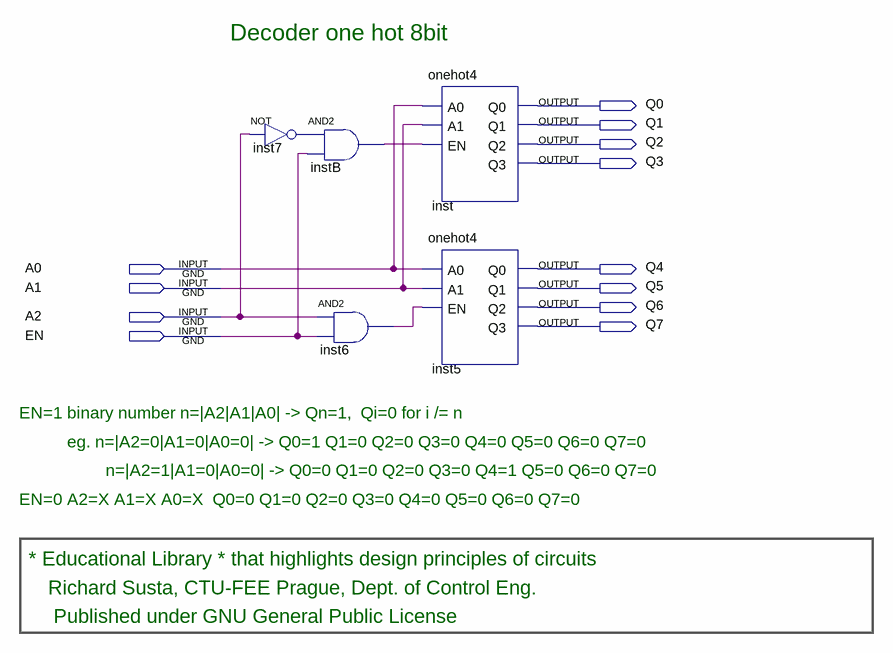
[diagram p0: schematic sheet]
// Quartus schematic onehot8.bdf as structural Verilog: 5 symbols, 12 pins
module onehot8 (
  input  A0,
  input  A1,
  input  A2,
  input  EN,
  output Q0,
  output Q1,
  output Q2,
  output Q3,
  output Q4,
  output Q5,
  output Q6,
  output Q7
);

  wire inst6_out, inst7_out, instB_out;

  not inst7 (inst7_out, A2);
  and instB (instB_out, inst7_out, EN);
  and inst6 (inst6_out, A2, EN);
  onehot4 inst (.A0(A0), .A1(A1), .EN(instB_out), .Q0(Q0), .Q1(Q1), .Q2(Q2), .Q3(Q3));
  onehot4 inst5 (.A0(A0), .A1(A1), .EN(inst6_out), .Q0(Q4), .Q1(Q5), .Q2(Q6), .Q3(Q7));

  // Notes on the sheet:
  //   Decoder one hot 8bit
  //   EN=1 binary number n=|A2|A1|A0| -> Qn=1,  Qi=0 for i /= n
  //   eg. n=|A2=0|A1=0|A0=0| -> Q0=1 Q1=0 Q2=0 Q3=0 Q4=0 Q5=0 Q6=0 Q7=0
  //   n=|A2=1|A1=0|A0=0| -> Q0=0 Q1=0 Q2=0 Q3=0 Q4=1 Q5=0 Q6=0 Q7=0
  //   EN=0 A2=X A1=X A0=X  Q0=0 Q1=0 Q2=0 Q3=0 Q4=0 Q5=0 Q6=0 Q7=0
  //   * Educational Library * that highlights design principles of circuits
  //   Richard Susta, CTU-FEE Prague, Dept. of Control Eng. 
  //    Published under GNU General Public License
endmodule
